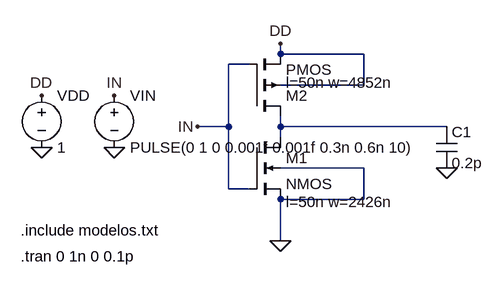
[diagram p0: schematic 1_d.asc]
1_d.asc, the LTspice schematic file:
Version 4
SHEET 1 880 680
WIRE 176 32 176 16
WIRE 304 32 176 32
WIRE 128 48 96 48
WIRE 304 80 304 32
WIRE 304 80 176 80
WIRE 96 144 96 48
WIRE 96 144 48 144
WIRE 176 144 176 128
WIRE 432 144 176 144
WIRE 176 160 176 144
WIRE 304 208 176 208
WIRE 96 240 96 144
WIRE 128 240 96 240
WIRE 304 256 304 208
WIRE 304 256 176 256
WIRE 176 320 176 256
FLAG -80 176 0
FLAG -192 176 0
FLAG 176 320 0
FLAG -192 96 DD
FLAG 176 16 DD
FLAG 48 144 IN
FLAG -80 96 IN
FLAG 432 208 0
SYMBOL nmos4 128 160 R0
WINDOW 123 56 100 Left 2
SYMATTR Value2 l=50n w=2426n
SYMATTR InstName M1
SYMBOL pmos4 128 128 M180
WINDOW 123 56 52 Left 2
SYMATTR Value2 l=50n w=4852n
SYMATTR InstName M2
SYMBOL voltage -192 80 R0
SYMATTR InstName VDD
SYMATTR Value 1
SYMBOL voltage -80 80 R0
WINDOW 123 0 0 Left 2
WINDOW 39 0 0 Left 2
SYMATTR InstName VIN
SYMATTR Value PULSE(0 1 0 0.001f 0.001f 0.3n 0.6n 10)
SYMBOL cap 416 144 R0
SYMATTR InstName C1
SYMATTR Value 0.2p
TEXT -224 304 Left 2 !.include modelos.txt
TEXT -224 344 Left 2 !.tran 0 1n 0 0.1p

The netlist it stands for:
* 1_d.asc
M1 N001 IN 0 0 NMOS l=50n w=2426n
M2 N001 IN DD DD PMOS l=50n w=4852n
VDD DD 0 1
VIN IN 0 PULSE(0 1 0 0.001f 0.001f 0.3n 0.6n 10)
C1 N001 0 0.2p
.model NMOS NMOS
.model PMOS PMOS
.lib standard.mos
.include modelos.txt
.tran 0 1n 0 0.1p
.backanno
.end